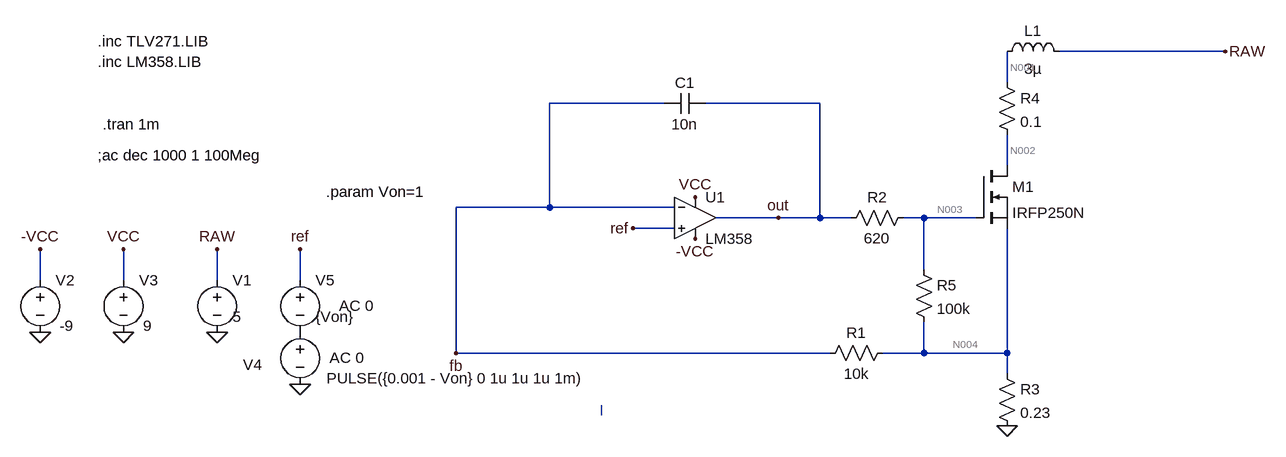
[diagram p0: schematic mosfet-stability-pulse.asc]
mosfet-stability-pulse.asc, the LTspice schematic file:
Version 4
SHEET 1 1508 680
WIRE 1024 -240 768 -240
WIRE 688 -192 688 -240
WIRE 160 -160 -16 -160
WIRE 400 -160 224 -160
WIRE 688 -64 688 -112
WIRE -16 0 -16 -160
WIRE -16 0 -160 0
WIRE 176 0 -16 0
WIRE 336 16 240 16
WIRE 400 16 400 -160
WIRE 400 16 336 16
WIRE 448 16 400 16
WIRE 560 16 528 16
WIRE 640 16 560 16
WIRE 176 32 112 32
WIRE 560 96 560 16
WIRE -800 112 -800 64
WIRE -672 112 -672 64
WIRE -528 112 -528 64
WIRE -400 112 -400 64
WIRE -160 224 -160 0
WIRE 416 224 -160 224
WIRE 560 224 560 176
WIRE 560 224 496 224
WIRE 688 224 688 32
WIRE 688 224 560 224
WIRE 688 256 688 224
WIRE 64 320 64 304
FLAG -528 192 0
FLAG -528 64 RAW
FLAG 208 -16 VCC
FLAG -672 192 0
FLAG -672 64 VCC
FLAG -160 224 fb
FLAG 688 336 0
FLAG 1024 -240 RAW
FLAG 336 16 out
FLAG -800 192 0
FLAG -800 64 -VCC
FLAG 208 48 -VCC
FLAG -400 272 0
FLAG -400 64 ref
FLAG 112 32 ref
SYMBOL voltage -528 96 R0
WINDOW 123 24 44 Left 2
WINDOW 39 0 0 Left 0
WINDOW 3 24 72 Left 2
SYMATTR Value 5
SYMATTR InstName V1
SYMBOL voltage -672 96 R0
WINDOW 123 24 44 Left 2
WINDOW 39 0 0 Left 0
WINDOW 3 30 86 Left 2
SYMATTR Value 9
SYMATTR InstName V3
SYMBOL nmos 640 -64 R0
SYMATTR InstName M1
SYMATTR Value IRFP250N
SYMBOL res 672 240 R0
SYMATTR InstName R3
SYMATTR Value 0.23
SYMBOL res 672 -208 R0
SYMATTR InstName R4
SYMATTR Value 0.1
SYMBOL voltage -800 96 R0
WINDOW 123 24 44 Left 2
WINDOW 39 0 0 Left 0
WINDOW 3 30 86 Left 2
SYMATTR Value -9
SYMATTR InstName V2
SYMBOL voltage -400 96 R0
WINDOW 123 60 55 Left 2
WINDOW 39 0 0 Left 0
WINDOW 3 24 72 Left 2
SYMATTR Value2 AC 0
SYMATTR Value {Von}
SYMATTR InstName V5
SYMBOL ind 672 -224 R270
WINDOW 0 32 56 VTop 2
WINDOW 3 5 56 VBottom 2
SYMATTR InstName L1
SYMATTR Value 3µ
SYMBOL OpAmps\\opamp2 208 -48 R0
SYMATTR InstName U1
SYMATTR Value LM358
SYMBOL res 512 208 R90
WINDOW 0 0 56 VBottom 2
WINDOW 3 32 56 VTop 2
SYMATTR InstName R1
SYMATTR Value 10k
SYMBOL res 544 0 R90
WINDOW 0 0 56 VBottom 2
WINDOW 3 32 56 VTop 2
SYMATTR InstName R2
SYMATTR Value 620
SYMBOL cap 224 -176 R90
WINDOW 0 0 32 VBottom 2
WINDOW 3 32 32 VTop 2
SYMATTR InstName C1
SYMATTR Value 10n
SYMBOL res 544 80 R0
SYMATTR InstName R5
SYMATTR Value 100k
SYMBOL voltage -400 176 R0
WINDOW 123 45 55 Left 2
WINDOW 39 0 0 Left 0
WINDOW 3 41 87 Left 2
WINDOW 0 -88 66 Left 2
SYMATTR Value2 AC 0
SYMATTR Value PULSE({0.001 - Von} 0 1u 1u 1u 1m)
SYMATTR InstName V4
TEXT -712 -80 Left 2 !;ac dec 1000 1 100Meg
TEXT -712 -256 Left 2 !.inc TLV271.LIB
TEXT -712 -224 Left 2 !.inc LM358.LIB
TEXT -704 -128 Left 2 !.tran 1m
TEXT -360 -24 Left 2 !.param Von=1

The netlist it stands for:
* mosfet-stability-pulse.asc
V1 RAW 0 5
V3 VCC 0 9
M1 N002 N003 N004 N004 IRFP250N
R3 N004 0 0.23
R4 N001 N002 0.1
V2 -VCC 0 -9
V5 ref P001 {Von} AC 0
L1 N001 RAW 3µ
XU1 ref fb VCC -VCC out LM358  ; pins In+ In- V+ V- OUT
R1 N004 fb 10k
R2 N003 out 620
C1 out fb 10n
R5 N003 N004 100k
V4 P001 0 PULSE({0.001 - Von} 0 1u 1u 1u 1m) AC 0
.model NMOS NMOS
.model PMOS PMOS
.lib standard.mos
;ac dec 1000 1 100Meg
.inc TLV271.LIB
.inc LM358.LIB
.tran 1m
.param Von=1
.backanno
.end

* Results of the author's LTspice run, read from the files saved beside the schematic
* Operating Point, zero values left out:
*   V(raw) = 5 V
*   V(vcc) = 9 V
*   V(n002) = 5 V
*   V(n003) = 3.886 V
*   V(n004) = 1.134 mV
*   V(n001) = 5 V
*   V(-vcc) = -9 V
*   V(ref) = 1 mV
*   V(p001) = -999 mV
*   V(out) = 3.91 V
*   V(fb) = 1.229 mV
*   Id(M1) = 4.889 mA
*   Is(M1) = -4.889 mA
*   I(L1) = -4.889 mA
*   I(R3) = 4.928 mA
*   I(R4) = 4.889 mA
*   I(R1) = -9.5 nA
*   I(R2) = -38.85 µA
*   I(R5) = 38.85 µA
*   I(V1) = -4.889 mA
*   I(V3) = -338.8 µA
*   I(V2) = 300 µA
*   I(V5) = 10 nA
*   I(V4) = 10 nA
*   Ix(u1:IN+) = -10 nA
*   Ix(u1:IN-) = -9.5 nA
*   Ix(u1:VCC) = 338.8 µA
*   Ix(u1:VEE) = -300 µA
*   Ix(u1:OUT) = -38.85 µA
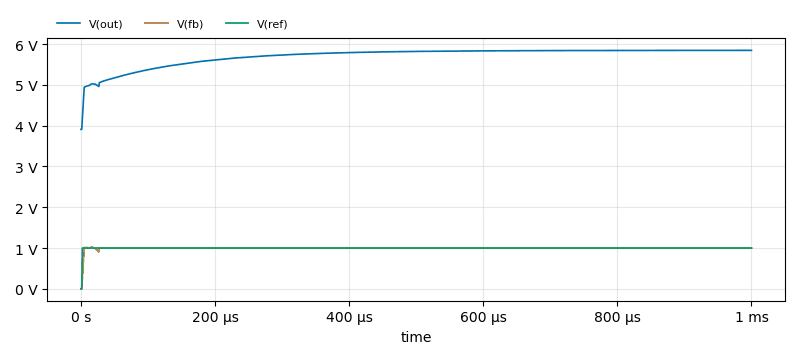
[diagram p1: Transient Analysis of mosfet-stability-pulse.asc, plotted from the saved traces]
* Transient Analysis, 1 run:
*   V(out): min 3.91 V, max 5.847 V, average 5.71 V, rms 5.714 V, last 5.847 V
*   V(fb): min 1.229 mV, max 1.022 V, average 997.1 mV, rms 998.3 mV, last 1 V
*   V(ref): min 1 mV, max 1 V, average 998.5 mV, rms 999.2 mV, last 1 V